# EAGLE design Micro_Bit_Breakout (EAGLE 7.2.0)
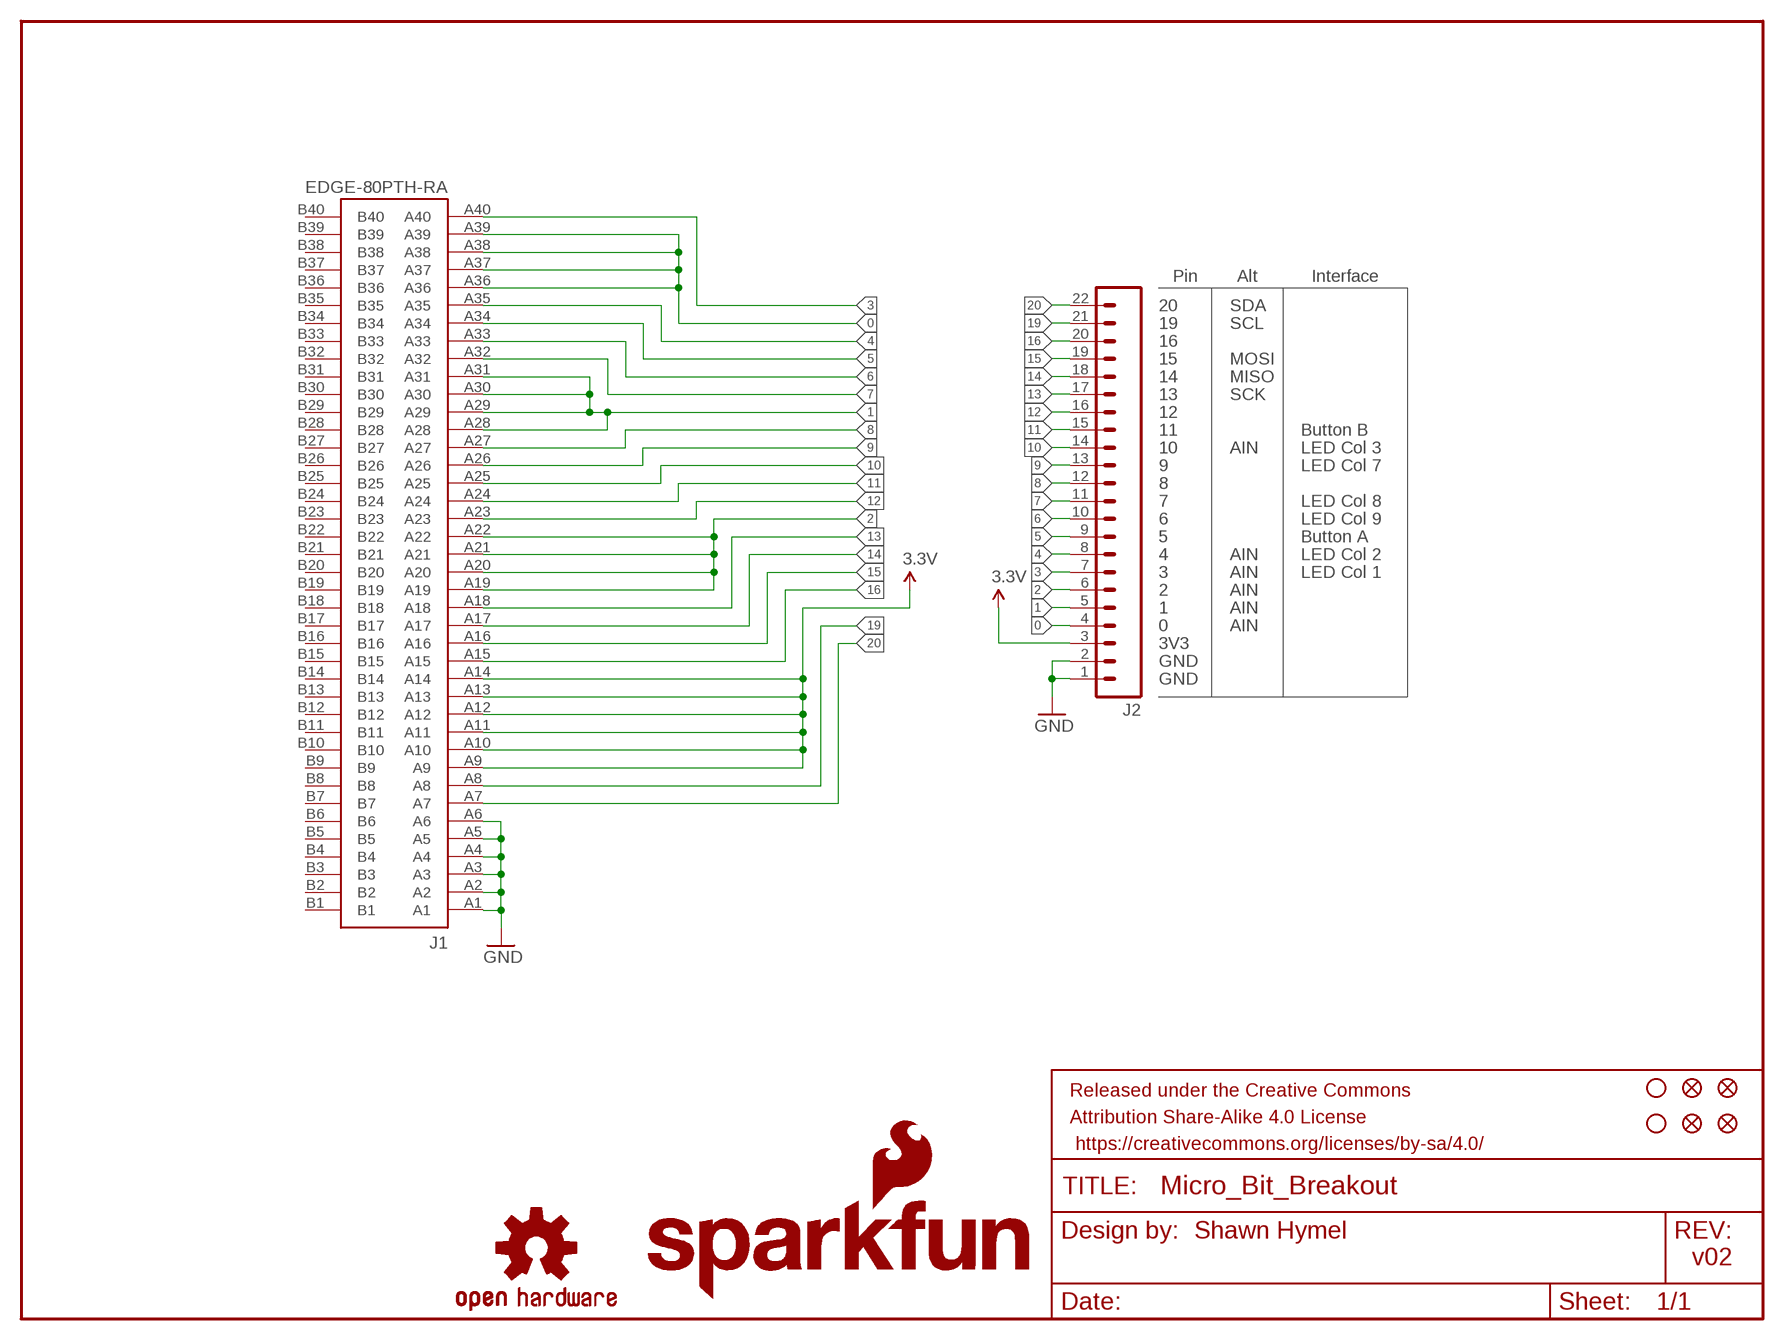
[diagram p0: schematic, sheet 1]

## Parts
FD1  FIDUCIAL1X2  [FIDUCIAL-1X2]
FD2  FIDUCIAL1X2  [FIDUCIAL-1X2]
FD3  FIDUCIAL1X2  [FIDUCIAL-1X2]
FD4  FIDUCIAL1X2  [FIDUCIAL-1X2]
FRAME1  FRAME-LETTER  [CREATIVE_COMMONS]
H1  STAND-OFF  [STAND-OFF]
H2  STAND-OFF  [STAND-OFF]
J1  EDGE-80PTH-RA  [VEC-127-080-R]
J2  M22PTH  [1X22]
LOGO2  SFE_LOGO_NAME_FLAME.1_INCH  [SFE_LOGO_NAME_FLAME_.1]
LOGO3  OSHW-LOGOS  [OSHW-LOGO-S]

## Nets
0: J1.A36 J1.A37 J1.A38 J1.A39 J2.4
1: J1.A28 J1.A29 J1.A30 J1.A31 J2.5
2: J1.A19 J1.A20 J1.A21 J1.A22 J2.6
3: J1.A40 J2.7
3.3V: J1.A9 J1.A10 J1.A11 J1.A12 J1.A13 J1.A14 J2.3
4: J1.A35 J2.8
5: J1.A34 J2.9
6: J1.A33 J2.10
7: J1.A32 J2.11
8: J1.A27 J2.12
9: J1.A26 J2.13
10: J1.A25 J2.14
11: J1.A24 J2.15
12: J1.A23 J2.16
13: J1.A18 J2.17
14: J1.A17 J2.18
15: J1.A16 J2.19
16: J1.A15 J2.20
19: J1.A8 J2.21
20: J1.A7 J2.22
GND: J1.A1 J1.A2 J1.A3 J1.A4 J1.A5 J1.A6 J2.1 J2.2
Unconnected: J1.B1 J1.B2 J1.B3 J1.B4 J1.B5 J1.B6 J1.B7 J1.B8 J1.B9 J1.B10 J1.B11 J1.B12 J1.B13 J1.B14 J1.B15 J1.B16 J1.B17 J1.B18 J1.B19 J1.B20 J1.B21 J1.B22 J1.B23 J1.B24 J1.B25 J1.B26 J1.B27 J1.B28 J1.B29 J1.B30 J1.B31 J1.B32 J1.B33 J1.B34 J1.B35 J1.B36 J1.B37 J1.B38 J1.B39 J1.B40

## Notes on the sheet
- Pin | Alt | Interface
- 20 | SDA
- 19 | SCL
- 16
- 15 | MOSI
- 14 | MISO
- 13 | SCK
- 12
- 11 | Button B
- 10 | AIN | LED Col 3
- 9 | LED Col 7
- 8
- 7 | LED Col 8
- 6 | LED Col 9
- 5 | Button A
- 4 | AIN | LED Col 2
- 3 | AIN | LED Col 1
- 2 | AIN
- 1 | AIN
- 0 | AIN
- 3V3
- GND
- GND
- Shawn Hymel
- v02

## Library data of the parts
FD1-FD4 = SparkFun-Aesthetics:FIDUCIAL: Fiducial Alignment Points Various fiducial points for machine vision alignment.
FRAME1 = SparkFun-Aesthetics:FRAME-LETTER: Schematic Frame Standard 8.5x11 US Letter frame
H1 H2 = SparkFun-Electromechanical:STAND-OFF: #4 Stand Off This is the mechanical footprint for a #4 phillips button head screw. Use the keepout ring to avoid running the screw head into surrounding components. SKU : PRT-00447
J1 = local_lib:EDGE-80: Card edge connector (80 pin) for accepting a PCB with finger edge pins. This connector will accept the BBC micro:bit board.; PROD_ID: CONN-13452
J2 = local_lib:M22: Standard 22-pin 0.1" header; PROD_ID: CONN-13453
LOGO2 = SparkFun-Aesthetics:SFE_LOGO_NAME_FLAME: SFE Logo, name and flame This is the SparkFun full logo. The logo on the schematic will always be the same size; the package variant is the height of the flame part of the logo. Default layer for the logo on the board is tSilk.
LOGO3 = SparkFun-Aesthetics:OSHW-LOGO: Open Source Hardware Logo This logo indicates the piece of hardware it is found on incorporates a OSHW license and/or adheres to the definition of open source hardware found here: http://freedomdefined.org/OSHW

## Board
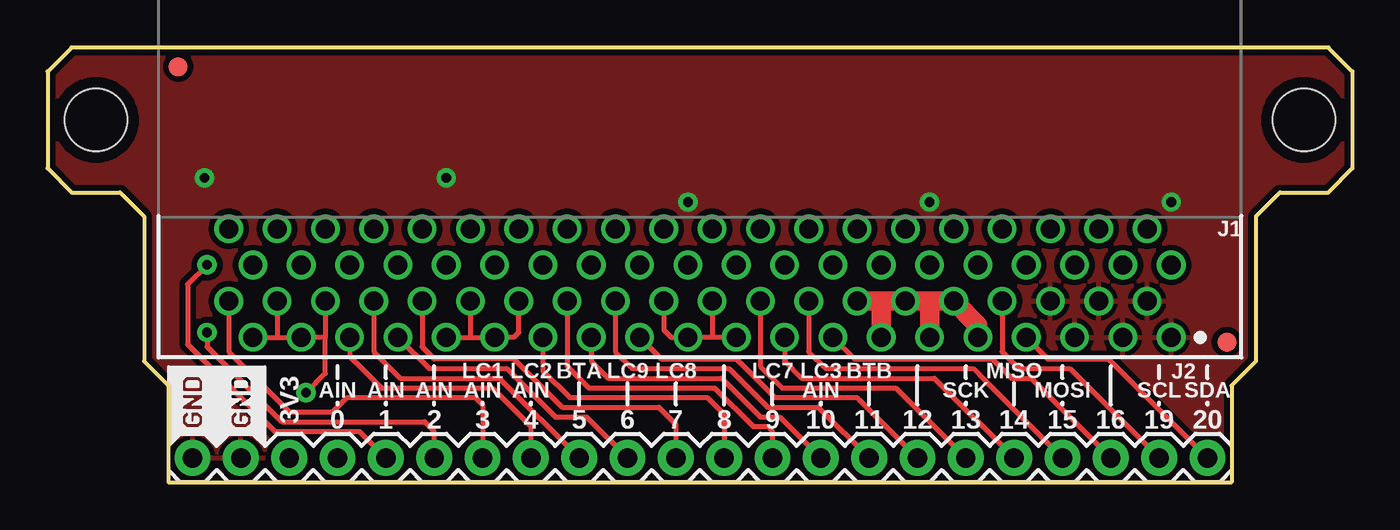
[diagram p1: board, top side]
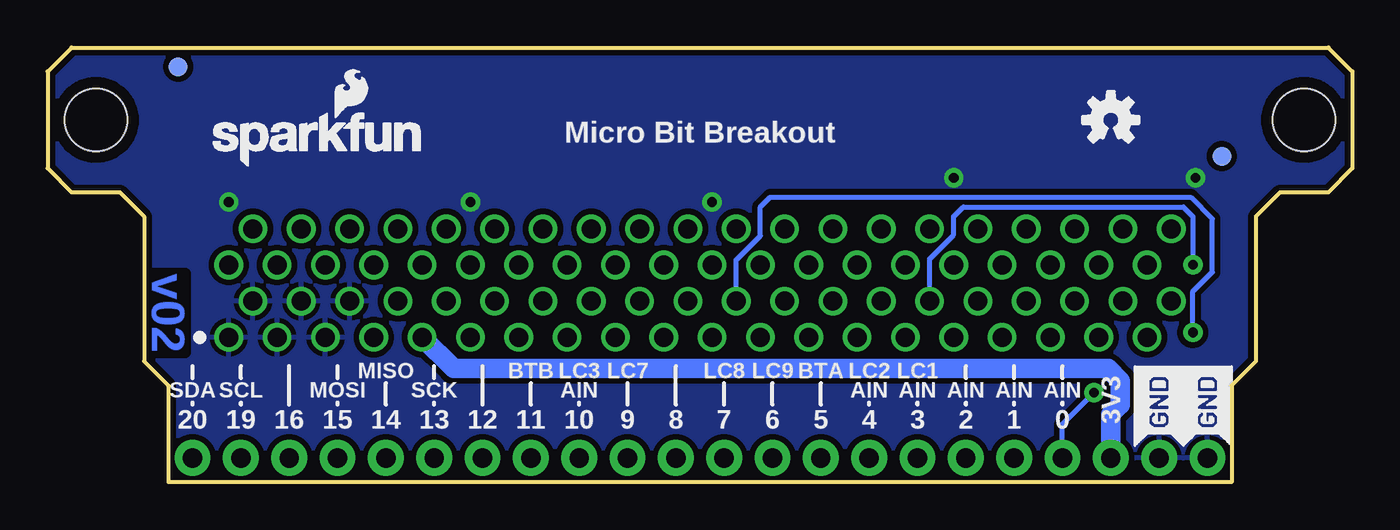
[diagram p2: board, bottom side, seen from below]

Size 68.58 x 22.86 mm. Coordinates in mm from the lower left corner, seen from the top.
Outline: 6.35,0 62.23,0 62.23,5.08 63.5,6.35 63.5,13.97 64.77,15.24 67.31,15.24 68.58,16.51 68.58,21.59 67.31,22.86 1.27,22.86 0,21.59 0,16.51 1.27,15.24 3.81,15.24 5.08,13.97 5.08,6.35 6.35,5.08 6.35,0
Copper layers (1*16): Top 0.035mm / dielectric 1.5mm / Bottom 0.035mm
Design rules "SparkFun-2-layer-STANDARD": minimum track width 10mil, minimum drill 20mil, track to track 10mil, track to pad 8mil, pad to pad 8mil, via to via 10mil, smd to smd 8mil, copper to edge 8mil, drill to drill 8mil, minimum pad ring 10mil, minimum via ring 10mil, stop-mask expansion 4mil, vias tented up to drill 25mil, thermal gap 10mil

### Footprints (pad centres in the part's own frame; a part is rotated, then mirrored left to right if it is on the bottom)
FIDUCIAL-1X2 = smd 1 x 1: 1 0,0
STAND-OFF = hole 3.302: 0,0
VEC-127-080-R = drill 1: A1 -24.765,0; A2 -23.495,-1.9; A3 -22.225,0; A4 -20.955,-1.9; A5 -19.685,0; A6 -18.415,-1.9; A7 -17.145,0; A8 -15.875,-1.9; A9 -14.605,0; A10 -13.335,-1.9; A11 -12.065,0; A12 -10.795,-1.9; A13 -9.525,0; A14 -8.255,-1.9; A15 -6.985,0; A16 -5.715,-1.9; A17 -4.445,0; A18 -3.175,-1.9; A19 -1.905,0; A20 -0.635,-1.9; A21 0.635,0; A22 1.905,-1.9; A23 3.175,0; A24 4.445,-1.9; A25 5.715,0; A26 6.985,-1.9; A27 8.255,0; A28 9.525,-1.9; A29 10.795,0; A30 12.065,-1.9; A31 13.335,0; A32 14.605,-1.9; A33 15.875,0; A34 17.145,-1.9; A35 18.415,0; A36 19.685,-1.9; A37 20.955,0; A38 22.225,-1.9; A39 23.495,0; A40 24.765,-1.9; B1 -24.765,-3.8; B2 -23.495,-5.7; B3 -22.225,-3.8; B4 -20.955,-5.7; B5 -19.685,-3.8; B6 -18.415,-5.7; B7 -17.145,-3.8; B8 -15.875,-5.7; B9 -14.605,-3.8; B10 -13.335,-5.7; B11 -12.065,-3.8; B12 -10.795,-5.7; B13 -9.525,-3.8; B14 -8.255,-5.7; B15 -6.985,-3.8; B16 -5.715,-5.7; B17 -4.445,-3.8; B18 -3.175,-5.7; B19 -1.905,-3.8; B20 -0.635,-5.7; B21 0.635,-3.8; B22 1.905,-5.7; B23 3.175,-3.8; B24 4.445,-5.7; B25 5.715,-3.8; B26 6.985,-5.7; B27 8.255,-3.8; B28 9.525,-5.7; B29 10.795,-3.8; B30 12.065,-5.7; B31 13.335,-3.8; B32 14.605,-5.7; B33 15.875,-3.8; B34 17.145,-5.7; B35 18.415,-3.8; B36 19.685,-5.7; B37 20.955,-3.8; B38 22.225,-5.7; B39 23.495,-3.8; B40 24.765,-5.7
1X22 = drill 1.016 pad 1.88: 1 0,0; 2 2.54,0; 3 5.08,0; 4 7.62,0; 5 10.16,0; 6 12.7,0; 7 15.24,0; 8 17.78,0; 9 20.32,0; 10 22.86,0; 11 25.4,0; 12 27.94,0; 13 30.48,0; 14 33.02,0; 15 35.56,0; 16 38.1,0; 17 40.64,0; 18 43.18,0; 19 45.72,0; 20 48.26,0; 21 50.8,0; 22 53.34,0

### Placement (x,y rotation side)
FD1  6.86,21.84 0 top
FD2  61.98,7.37 0 top
FD3  61.72,21.84 0 bottom
FD4  6.86,17.14 0 bottom
FRAME1  0,-11.43 0 top  (outside the outline)
H1  2.54,19.05 0 top
H2  66.04,19.05 0 top
J1  34.29,7.62 180 top
J2  7.62,1.27 0 top
LOGO2  60.33,16.51 0 bottom
LOGO3  12.7,19.05 0 bottom
U$1  [NEGASILK_MICRO_BIT_BREAKOUT]  6.35,1.91 0 top
U$2  [NEGASILK_MICRO_BIT_BREAKOUT]  11.43,1.91 0 bottom

### Tracks (layer width: path | path; a pad name or v marks a point on that pad's centre or on a via)
0  (via drill 0.51)
  Top 0.254: J1.A39 12.06,7.62 | 12.06,7.62 J1.A37 14.61,7.62 | J1.A38 12.06,7.62 | J1.A36 14.61,7.62 | v13.59,4.7 14.61,5.71 14.61,7.62
  Bottom 0.254: J2.4 15.24,3.05 v13.59,4.7
1  (via drill 0.51)
  Top 0.254: J1.A31 22.23,7.62 | 22.23,7.62 J1.A29 24.51,7.62 24.77,7.87 J1.A28 | J2.5 16.38,2.67 11.94,2.67 7.37,7.24 7.37,10.41 v8.38,11.43 | J1.A30 22.23,7.62
  Bottom 0.254: v8.38,11.43 8.38,13.97 8.89,14.48 20.45,14.48 20.95,13.97 20.95,13.01 22.23,11.73 J1.A30
2  (via drill 0.51)
  Top 0.254: J1.A19 34.92,7.62 | 34.92,7.62 J1.A21 32.77,7.62 32.38,8 J1.A22 | J1.A20 34.92,7.62 | J2.6 20.32,2.67 19.81,3.17 12.32,3.17 8.38,7.11 v8.38,7.87
  Bottom 0.254: J1.A22 32.38,11.68 31.11,12.95 31.11,14.48 30.61,14.99 8.51,14.99 7.37,13.84 7.37,11.05 8.38,10.03 v8.38,7.87
3
  Top 0.254: J2.7 22.86,4.06 22.48,4.45 15.75,4.45 14.99,3.68 12.7,3.68 9.53,6.86 J1.A40
3.3V
  Top 1.016: J1.A9 48.9,8.25 J1.A10 46.23,9.52 | 46.23,9.52 J1.A12 43.69,9.52 | 43.69,9.52 J1.A14 | J1.A13 43.81,9.39 43.69,9.52 | J1.A11 46.35,9.39 46.23,9.52
  Bottom 1.016: J2.3 12.7,3.56 12.19,4.06 12.19,5.33 12.83,5.97 47.24,5.97 J1.A9
4
  Top 0.254: J1.A35 15.88,6.6 17.53,4.95 23.37,4.95 25.4,2.92 J2.8
5
  Top 0.254: J1.A34 17.14,6.86 18.54,5.46 23.75,5.46 J2.9
6
  Top 0.254: J2.10 28.32,3.43 26.67,3.43 24.13,5.97 20.07,5.97 J1.A33
7
  Top 0.254: J2.11 33.02,3.05 32.13,3.94 27.05,3.94 24.51,6.48 20.32,6.48 19.68,7.11 J1.A32
8
  Top 0.254: J1.A27 26.04,5.84 27.43,4.45 34.67,4.45 35.56,3.56 J2.12
9
  Top 0.254: J1.A26 27.3,6.1 28.45,4.95 35.05,4.95 37.08,2.92 37.85,2.92 38.1,2.67 J2.13
10
  Top 0.254: J2.14 38.48,3.43 37.47,3.43 35.43,5.46 29.46,5.46 28.57,6.35 J1.A25
11
  Top 0.254: J2.15 40.51,3.94 37.85,3.94 35.81,5.97 30.73,5.97 29.84,6.86 J1.A24
12
  Top 0.254: J2.16 42.67,4.32 42.55,4.45 38.23,4.45 36.2,6.48 32.26,6.48 J1.A23
13
  Top 0.254: J1.A18 37.47,6.1 38.61,4.95 44.58,4.95 J2.17
14
  Top 0.254: J1.A17 38.73,6.35 39.62,5.46 46.61,5.46 J2.18
15
  Top 0.254: J1.A16 40.01,6.86 40.89,5.97 48.64,5.97 49.28,5.33 49.78,4.83 J2.19
16
  Top 0.254: J1.A15 42.42,6.48 49.66,6.48 50.67,5.46 51.69,5.46 J2.20
19
  Top 0.254: J1.A8 50.16,6.86 51.05,5.97 53.72,5.97 J2.21
20
  Top 0.254: J1.A7 52.58,6.48 55.75,6.48 J2.22
GND  (via drill 0.51)
  other vias: 8.26,16 59.05,14.73 46.35,14.73 33.66,14.73 20.95,16
  pour Top (isolate 0.305): 0,22.86 0,0 68.58,0 68.58,22.86
  pour Bottom (isolate 0.305): 0,22.86 0,0 68.58,0 68.58,22.86

### Text on the board
Bottom: v02
tPlace: LC1 | LC2 | BTA | LC9 | LC8 | LC7 | LC3 | BTB | MISO | AIN | AIN | AIN | AIN | AIN | AIN | SCK | MOSI | SCL | SDA | 3V3 | 0 | 1 | 2 | 3 | 4 | 5 | 6 | 7 | 8 | 9 | 10 | 11 | 12 | 13 | 14 | 15 | 16 | 19 | 20
bPlace: Micro Bit Breakout | LC1 | LC2 | BTA | LC9 | LC8 | LC7 | LC3 | BTB | MISO | AIN | AIN | AIN | AIN | AIN | AIN | SCK | MOSI | SCL | SDA | 3V3 | 0 | 1 | 2 | 3 | 4 | 5 | 6 | 7 | 8 | 9 | 10 | 11 | 12 | 13 | 14 | 15 | 16 | 19 | 20
Measures: * All dimensions / are in inches
tDocu: Shawn Hymel